# EAGLE design controle bt (EAGLE 7.6.0)
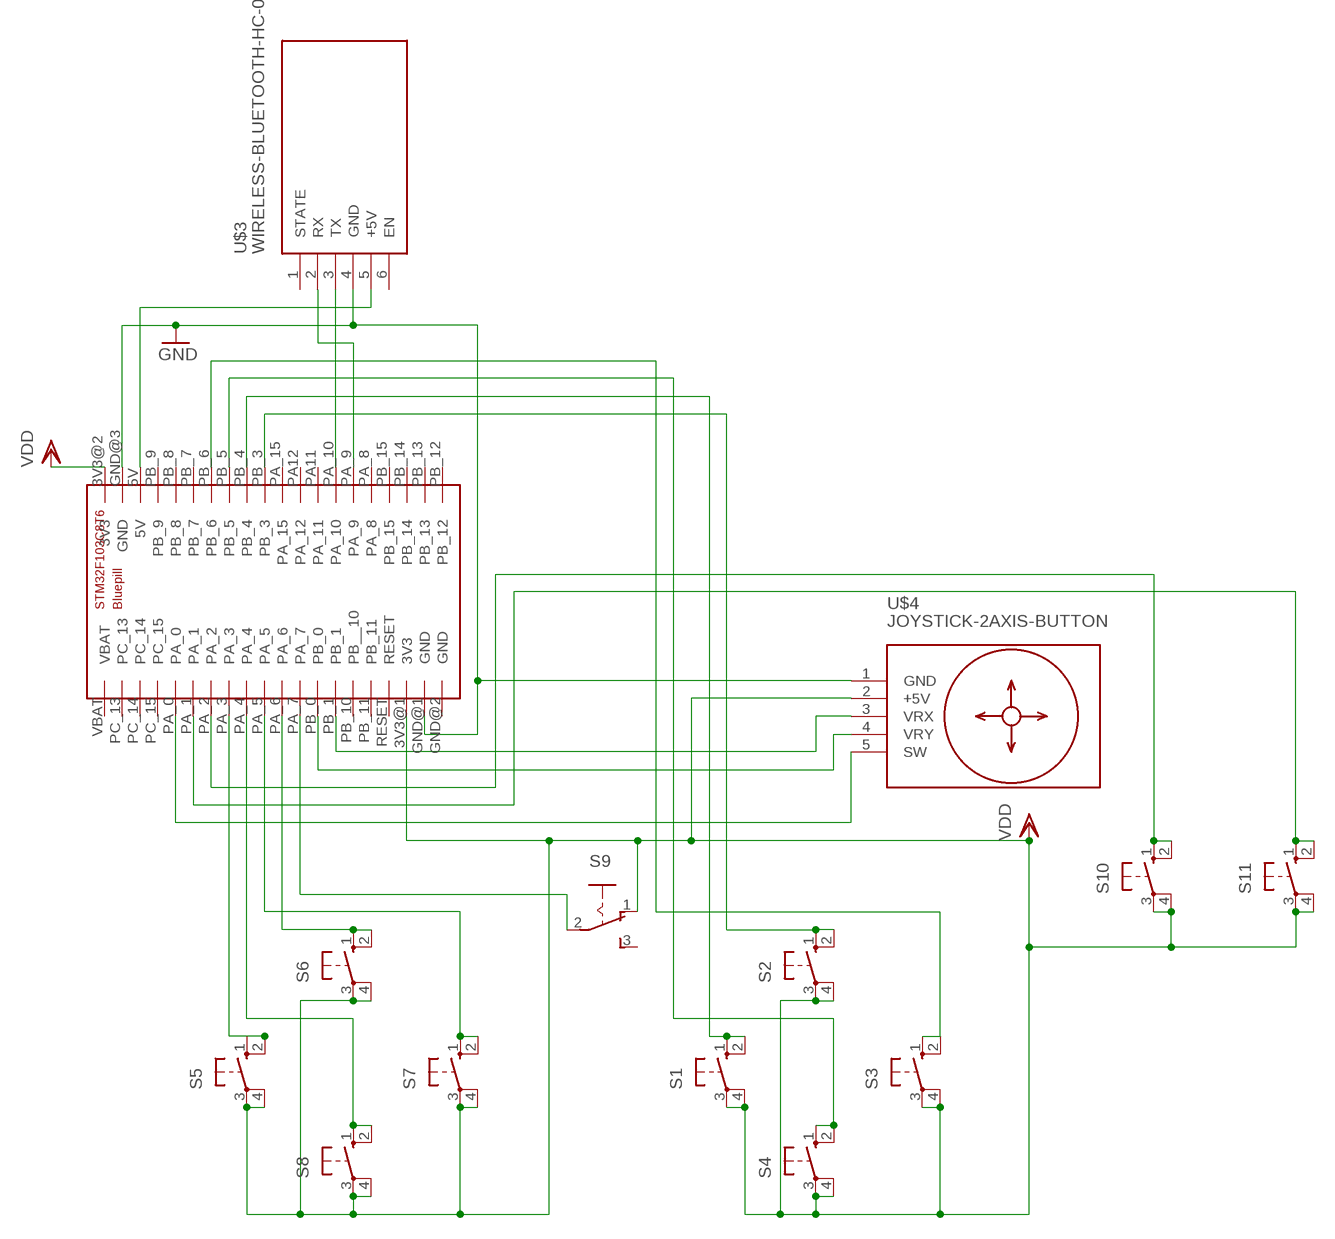
[diagram p0: schematic, sheet 1]

## Parts
S1  10-XX  [B3F-10XX]
S2  10-XX  [B3F-10XX]
S3  10-XX  [B3F-10XX]
S4  10-XX  [B3F-10XX]
S5  10-XX  [B3F-10XX]
S6  10-XX  [B3F-10XX]
S7  10-XX  [B3F-10XX]
S8  10-XX  [B3F-10XX]
S9  255SB  [255SB]
S10  10-XX  [B3F-10XX]
S11  10-XX  [B3F-10XX]
U$2  STM32_BLUEPILL  [STM32_BLUEPILL]
U$3  WIRELESS-BLUETOOTH-HC-05  [WIRELESS-BLUETOOTH-HC-05]
U$4  JOYSTICK-2AXIS-BUTTON  [JOYSTICK-2AXIS-BUTTON]

## Nets
GND: U$2.GND@1(GND) U$2.GND@3(GND) U$3.4(GND) U$4.1(GND)
N$1: S10.1(S) S10.2(S1) U$2.PA_2
N$2: U$2.PA_10 U$3.3(TX)
N$3: U$2.PA_9 U$3.2(RX)
N$5: S11.1(S) S11.2(S1) U$2.PA_1
N$6: U$2.5V U$3.5(+5V)
N$7: U$2.PA_0 U$4.5(SW)
N$8: U$2.PB_1 U$4.3(VRX)
N$9: U$2.PB_0 U$4.4(VRY)
N$10: S8.1(S) S8.2(S1) U$2.PA_4
N$11: S5.1(S) S5.2(S1) U$2.PA_3
N$12: S6.1(S) S6.2(S1) U$2.PA_6
N$16: S1.1(S) S1.2(S1) U$2.PB_4
N$17: S4.1(S) S4.2(S1) U$2.PB_5
N$18: S7.1(S) S7.2(S1) U$2.PA_5
N$20: S2.1(S) S2.2(S1) U$2.PB_3
N$21: S9.2(P) U$2.PA_7
N$24: S3.1(S) S3.2(S1) U$2.PB_6
VDD: S1.3(P) S1.4(P1) S2.3(P) S2.4(P1) S3.3(P) S3.4(P1) S4.3(P) S4.4(P1) S5.3(P) S5.4(P1) S6.3(P) S6.4(P1) S7.3(P) S7.4(P1) S8.3(P) S8.4(P1) S9.1(O) S10.3(P) S10.4(P1) S11.3(P) S11.4(P1) U$2.3V3@1(3V3) U$2.3V3@2(3V3) U$4.2(+5V)
Unconnected: S9.3(S) U$2.GND@2(GND) U$2.PA11(PA_11) U$2.PA12(PA_12) U$2.PA_8 U$2.PA_15 U$2.PB_7 U$2.PB_8 U$2.PB_9 U$2.PB_10(PB__10) U$2.PB_11 U$2.PB_12 U$2.PB_13 U$2.PB_14 U$2.PB_15 U$2.PC_13 U$2.PC_14 U$2.PC_15 U$2.RESET U$2.VBAT U$3.1(STATE) U$3.6(EN)

## Library data of the parts
S1-S8 S10 S11 = switch-omron:10-XX: OMRON SWITCH; MPN: B3F-1000; OC_FARNELL: 176432; OC_NEWARK: 36M3542
S9 = switch:255SB: SLIDING SWITCH Distributor Buerklin, 11G810
U$2 = stm32_bluepill:STM32_BLUEPILL
U$3 = diy-modules:WIRELESS-BLUETOOTH-HC-05: Bluetooth Transceiver Module based on HC-05 board Tutorial is available here: https://arduino-info.wikispaces.com/BlueTooth-HC05-HC06-Modules-How-To Click here to find device on ebay.com <http://www.ebay.com/sch/hc-05+module+rs232>
U$4 = diy-modules:JOYSTICK-2AXIS-BUTTON: 2-Axis Analog Joystick with Push Button Tutorial is available here: http://henrysbench.capnfatz.com/henrys-bench/arduino-sensors-and-input/arduino-ps2-joystick-tutorial-keyes-ky-023-deek-robot/ Click here to find device on ebay.com <http://www.ebay.com/sch/joystick+ps2+module>

## Board
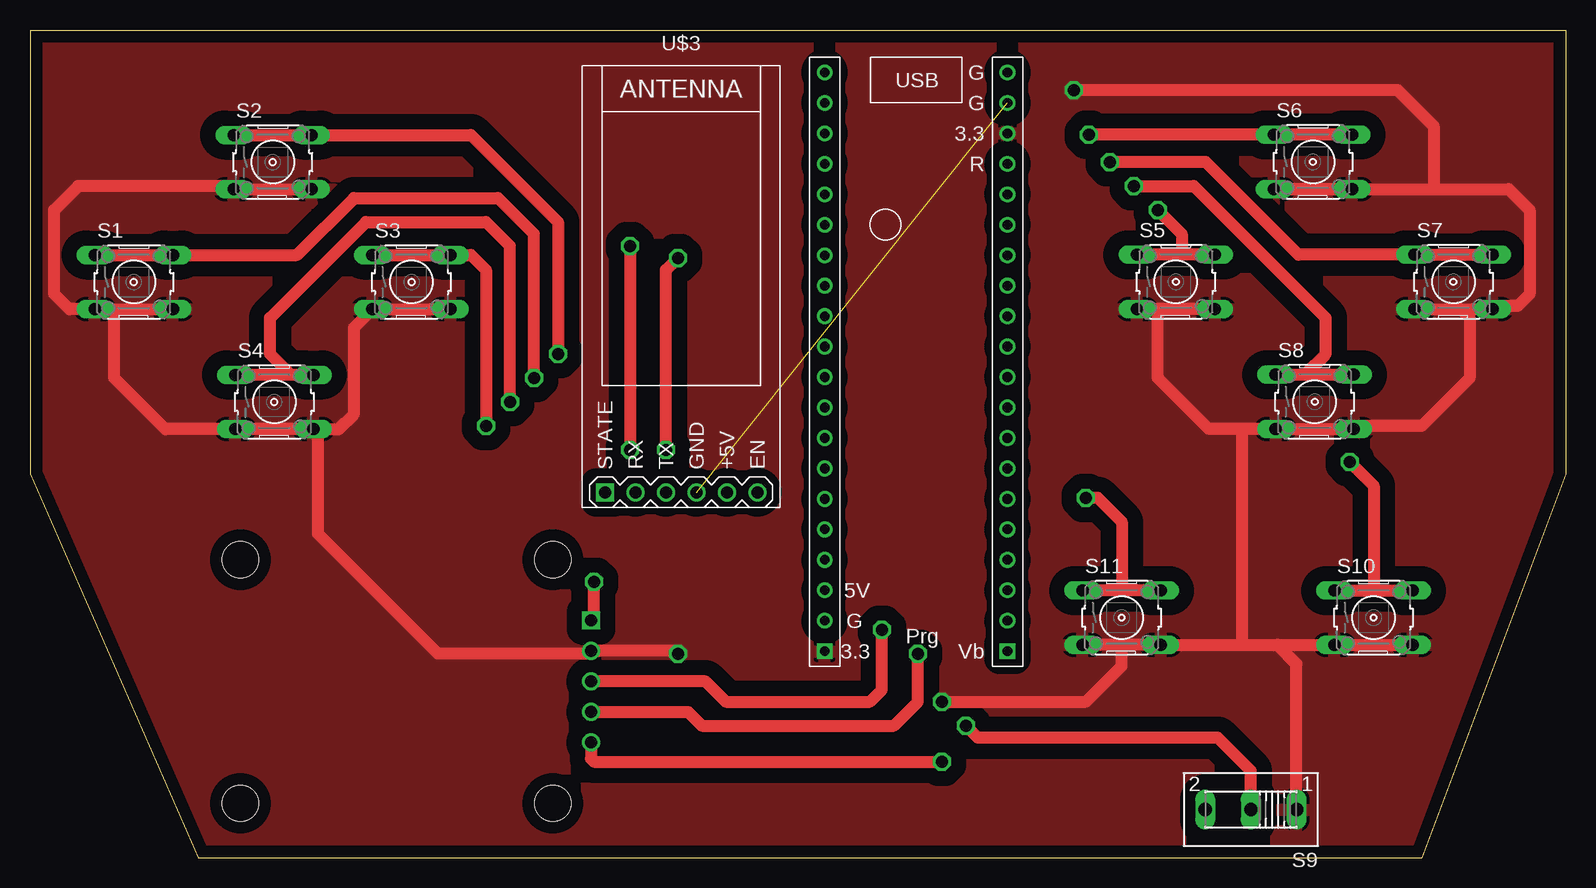
[diagram p1: board, top side]
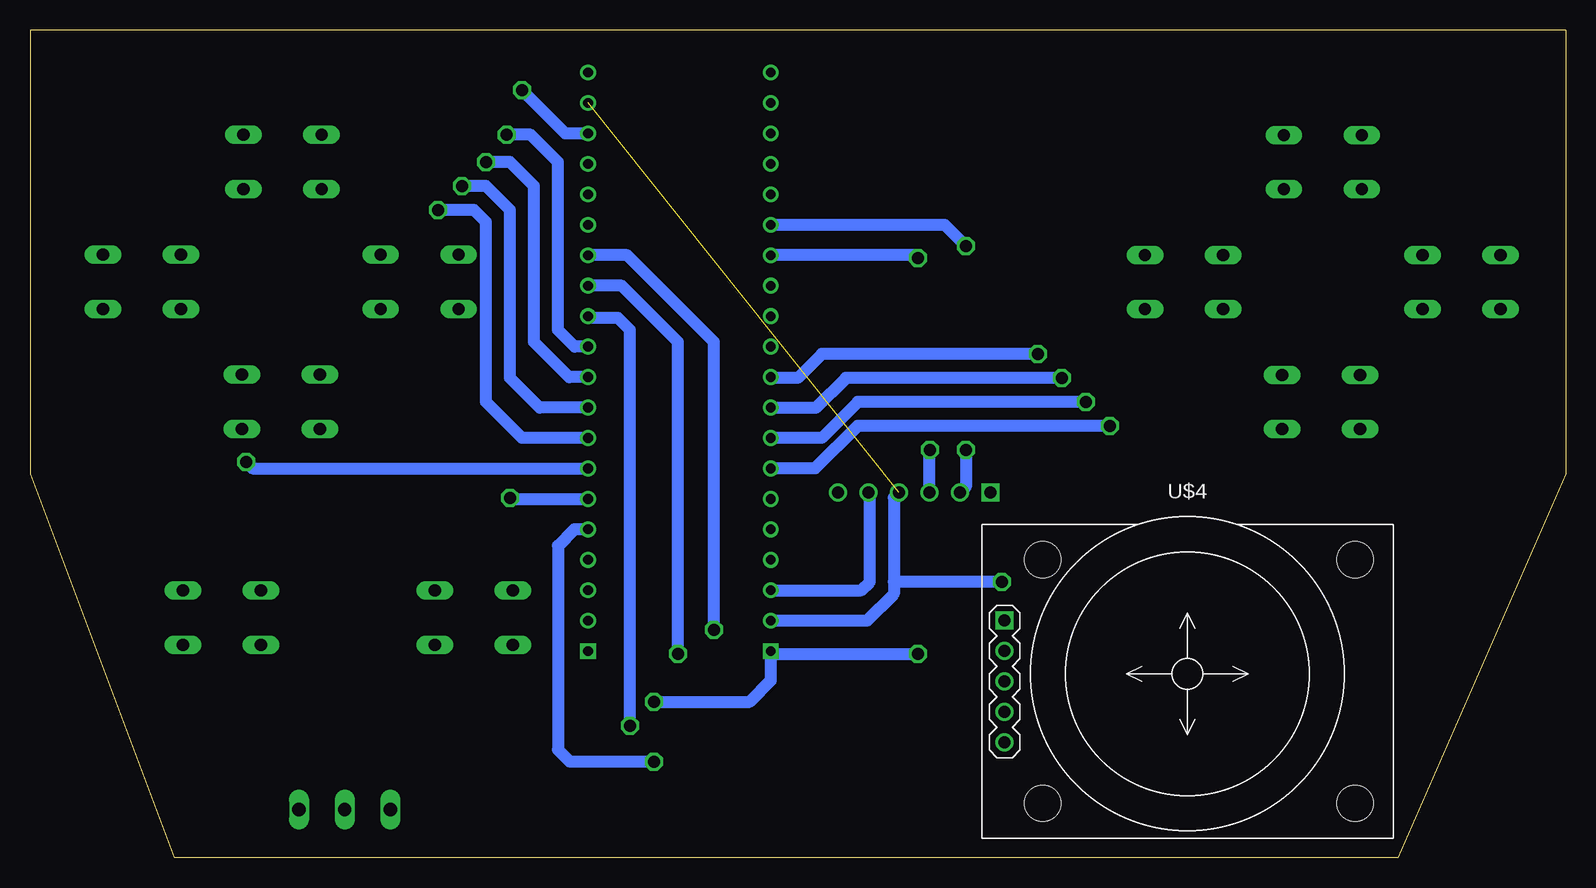
[diagram p2: board, bottom side, seen from below]

Size 128 x 69 mm. Coordinates in mm from the lower left corner, seen from the top.
Outline: 0,69 0,32 14,0 116,0 128,32 128,69 0,69
Copper layers (1*16): Top 0.035mm / dielectric 1.5mm / Bottom 0.035mm
Design rules "default *": minimum track width 10mil, minimum drill 24mil, track to track 50mil, track to pad 50mil, pad to pad 50mil, via to via 50mil, smd to smd 8mil, copper to edge 40mil, drill to drill 8mil, minimum pad ring 10mil, minimum via ring 8mil, stop-mask expansion 4mil, vias tented up to drill 0mil, thermal gap 10mil

### Footprints (pad centres in the part's own frame; a part is rotated, then mirrored left to right if it is on the bottom)
B3F-10XX = drill 1.016 long: 1 -3.251,2.261; 2 3.251,2.261; 3 -3.251,-2.261; 4 3.251,-2.261
255SB = drill 1.118 long: 1 -3.81,0; 2 0,0; 3 3.81,0
STM32_BLUEPILL = drill 0.8: 3V3@1 -7.62,-19.05; 5V 7.62,19.05; GND@1 -7.62,-21.59; GND@2 -7.62,-24.13; GND@3 7.62,21.59; PA11 7.62,-6.35; PA12 7.62,-3.81; PA_0 -7.62,13.97; PA_1 -7.62,11.43; PA_2 -7.62,8.89; PA_3 -7.62,6.35; PA_4 -7.62,3.81; PA_5 -7.62,1.27; PA_6 -7.62,-1.27; PA_7 -7.62,-3.81; PA_8 7.62,-13.97; PA_9 7.62,-11.43; PA_10 7.62,-8.89; PA_15 7.62,-1.27; PB_0 -7.62,-6.35; PB_1 -7.62,-8.89; PB_3 7.62,1.27; PB_4 7.62,3.81; PB_5 7.62,6.35; PB_6 7.62,8.89; PB_7 7.62,11.43; PB_8 7.62,13.97; PB_9 7.62,16.51; PB_10 -7.62,-11.43; PB_11 -7.62,-13.97; PB_12 7.62,-24.13; PB_13 7.62,-21.59; PB_14 7.62,-19.05; PB_15 7.62,-16.51; PC_13 -7.62,21.59; PC_14 -7.62,19.05; PC_15 -7.62,16.51; RESET -7.62,-16.51 | drill 0.8 square: 3V3@2 7.62,24.13; VBAT -7.62,24.13
WIRELESS-BLUETOOTH-HC-05 = drill 1 square: 1 -6.35,-17.145 | drill 1: 2 -3.81,-17.145; 3 -1.27,-17.145; 4 1.27,-17.145; 5 3.81,-17.145; 6 6.35,-17.145
JOYSTICK-2AXIS-BUTTON = drill 1 square: 1 -15.24,5.08 | drill 1: 2 -15.24,2.54; 3 -15.24,0; 4 -15.24,-2.54; 5 -15.24,-5.08 | hole 3: -12.065,10.16; -12.065,-10.16; 13.97,-10.16; 13.97,10.16

### Placement (x,y rotation side)
S1  8.66,47.98 0 top
S2  20.23,57.98 0 top
S3  31.8,47.98 0 top
S4  20.37,37.98 0 top
S5  95.52,48 0 top
S6  106.95,58 0 top
S7  118.66,48 0 top
S8  107.09,38 0 top
S9  101.77,4 180 top
S10  112,20 0 top
S11  91,20 0 top
U$2  73.86,41.33 180 top
U$3  54.28,47.59 0 top
U$4  31.52,14.68 0 bottom

### Tracks (layer width: path | path; a pad name or v marks a point on that pad's centre or on a via)
GND  (via drill 1)  (1 unrouted)
  Top 1.016: U$4.1 47,19.76 v47,23
  Bottom 1.016: U$2.GND@3 58.26,19.74 56,22 56,23 | U$3.4 56,30 56,23 | v47,23 56,23
N$1  (via drill 1)
  Top 1.016: S10.1 112,22.26 | 112,22.26 S10.2 | v110,33 112,31 112,22.26
  Bottom 1.016: v110,33 109.44,32.44 U$2.PA_2
N$2  (via drill 1)
  Top 1.016: v53,34 53,49 v54,50
  Bottom 1.016: U$3.3 v53.01,33.99 v53,34 | v54,50 54.22,50.22 U$2.PA_10
N$3  (via drill 1)
  Top 1.016: v50,51 v50,34
  Bottom 1.016: U$2.PA_9 51.76,52.76 v50,51 | v50,34 50,30.91 U$3.2
N$5  (via drill 1)
  Top 1.016: S11.2 91,22.26 | 91,22.26 S11.1 | 91,22.26 91,28 89,30 v88,30
  Bottom 1.016: v88,30 87.9,29.9 U$2.PA_1
N$6
  Bottom 1.016: U$2.5V 58.72,22.28 58,23 58,30.36 U$3.5
N$7  (via drill 1)
  Top 1.016: U$4.5 46.76,8.24 47,8 v76,8
  Bottom 1.016: U$2.PA_0 82.64,27.36 84,26 84,9 83,8 v76,8
N$8  (via drill 1)
  Top 1.016: v71,19 71,14 70,13 58,13 56.32,14.68 U$4.3
  Bottom 1.016: v71,19 71,43 78.22,50.22 U$2.PB_1
N$9  (via drill 1)
  Top 1.016: v74,17 74,13 72,11 56,11 54.86,12.14 U$4.4
  Bottom 1.016: v74,17 74,43 78.68,47.68 U$2.PB_0
N$10  (via drill 1)
  Top 1.016: S8.2 S8.1 106.26,40.26 108,42 108,45 97,56 v92,56
  Bottom 1.016: U$2.PA_4 85.52,37.52 88,40 88,54 90,56 v92,56
N$11  (via drill 1)
  Top 1.016: S5.2 96,50.26 | 96,50.26 S5.1 | v94,54 96,52 96,50.26
  Bottom 1.016: U$2.PA_3 86.98,34.98 90,38 90,53 91,54 v94,54
N$12  (via drill 1)
  Top 1.016: S6.2 S6.1 v88.26,60.26
  Bottom 1.016: U$2.PA_6 82.6,42.6 84,44 84,58 86.26,60.26 v88.26,60.26
N$16  (via drill 1)
  Top 1.016: S1.1 S1.2 22.24,50.24 27,55 39,55 42,52 v42,40
  Bottom 1.016: U$2.PB_4 62.48,37.52 60,40 v42,40
N$17  (via drill 1)
  Top 1.016: S4.1 S4.2 21.76,40.24 20,42 20,45 28,53 38,53 40,51 v40,38
  Bottom 1.016: v40,38 59,38 62,35 66.22,35 U$2.PB_5
N$18  (via drill 1)
  Top 1.016: S7.2 S7.1 105.74,50.26 98,58 v90,58
  Bottom 1.016: U$2.PA_5 83.06,40.06 86,43 86,56 88,58 v90,58
N$20  (via drill 1)
  Top 1.016: S2.1 S2.2 36.76,60.24 44,53 v44,42
  Bottom 1.016: v44,42 62,42 64,40 66.18,40 U$2.PB_3
N$21  (via drill 1)
  Top 1.016: S9.2 101.77,7.23 99,10 79,10 v78,11
  Bottom 1.016: v78,11 78,44 79,45 81.34,45 U$2.PA_7
N$24  (via drill 1)
  Top 1.016: S3.1 S3.2 36.76,50.24 38,49 v38,36
  Bottom 1.016: v38,36 59,36 62.56,32.44 U$2.PB_6
VDD  (via drill 1)
  Top 1.016: 91,17.74 S11.4 101,17.74 | 91,17.74 S11.3 | 101,17.74 104,17.74 | 104,17.74 S10.3 S10.4 | S2.3 S2.4 | 7,45.72 S1.3 3.28,45.72 2,47 2,54 4,56 17,56 17.28,55.72 | 7,45.72 S1.4 | 7,45.72 7,40 11.28,35.72 S4.3 S4.4 | S3.4 S3.3 27,44.17 27,37 25.72,35.72 S4.4 | S5.4 94,45.74 | 94,45.74 S5.3 | S6.4 S6.3 117,55.74 | 101,35.74 S8.3 S8.4 110.6,36 116,36 120,40 120,45 119.26,45.74 S7.3 S7.4 122.17,46 124,46 125,47 125,54 123.26,55.74 117,55.74 | 101,35.74 98.26,35.74 94,40 94,45.74 | 117,55.74 117,61 114,64 v87,64 | S9.1 105.58,16.16 104,17.74 | v76,13 88,13 91,16 91,17.74 | 101,35.74 101,17.74 | v54,17 53.78,17.22 U$4.2 46.54,17 34,17 24,27 24,35.34 S4.4
  Bottom 1.016: v87,64 83.38,60.38 U$2.3V3@1 | v54,17 66.04,17 U$2.3V3@2 66.24,14.76 68,13 v76,13
  pour Top: 1,68 1,33 15,1 115,1 127,32 127,68